# Altium schematic sheet Device.SchDoc
size A4
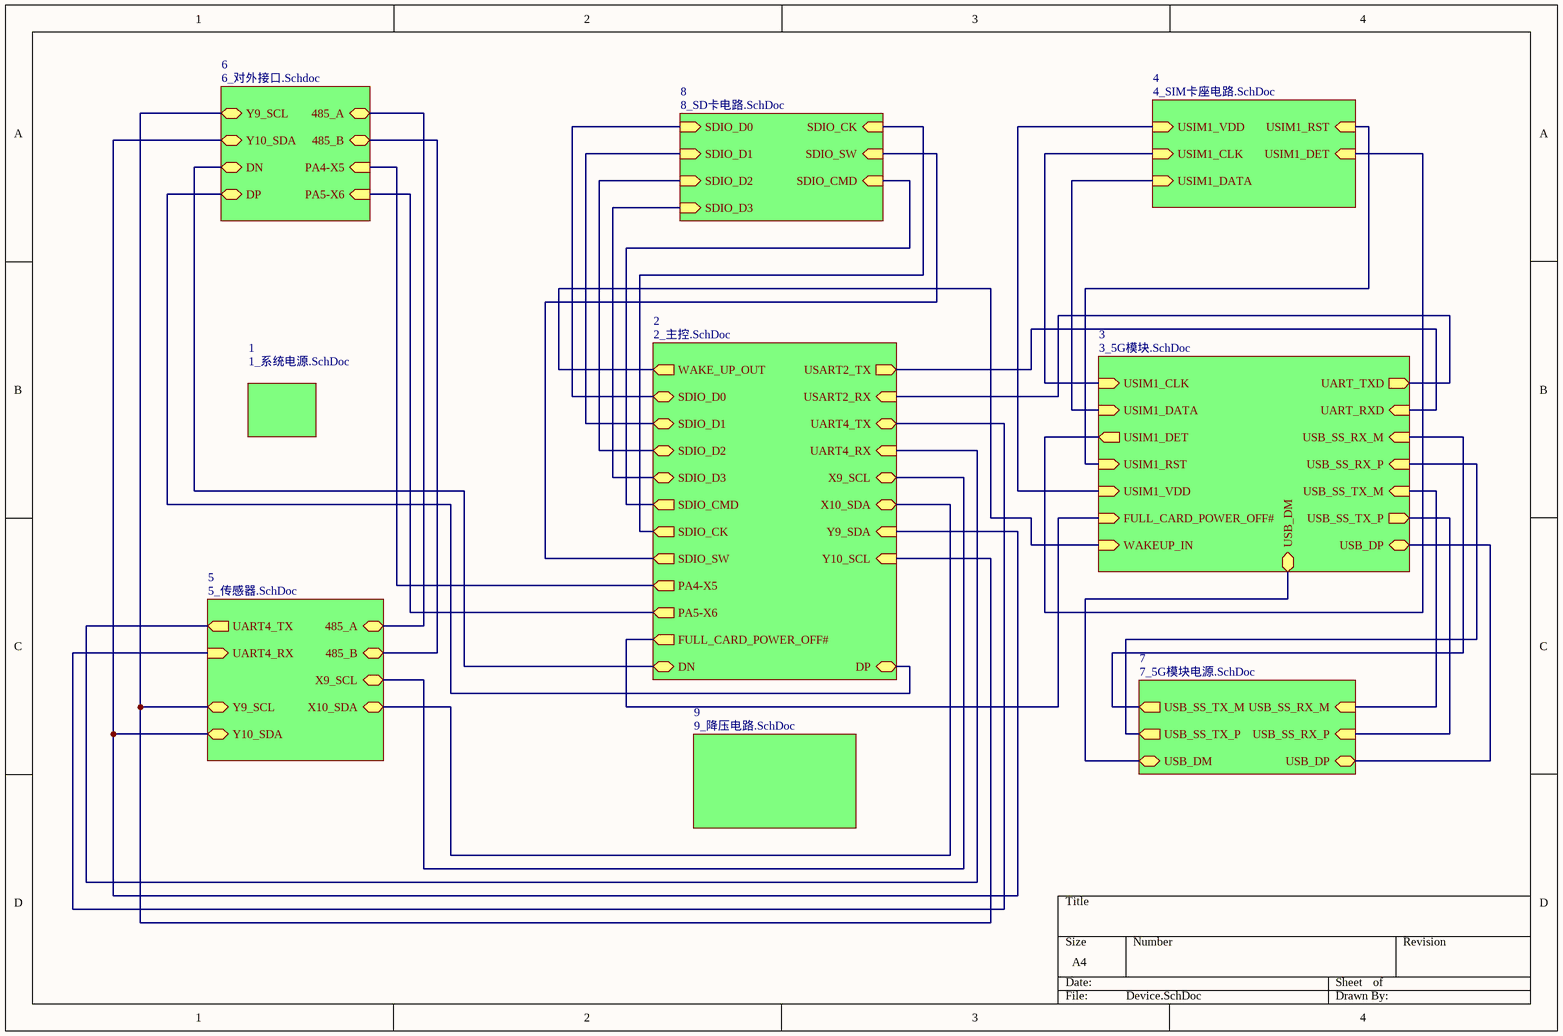
[diagram p0: Device.SchDoc]

## Sub-sheets
1 = 1_系统电源.SchDoc: no entries
2 = 2_主控.SchDoc: USART2_TX (out), USART2_RX (in), UART4_TX (bidir), UART4_RX (in), X9_SCL (bidir), X10_SDA (bidir), Y9_SDA (in), Y10_SCL (in), PA4-X5 (out), PA5-X6 (out), SDIO_D0 (bidir), SDIO_D1 (bidir), SDIO_D2 (bidir), SDIO_D3 (bidir), SDIO_SW (out), SDIO_CK (out), SDIO_CMD (out), FULL_CARD_POWER_OFF# (out), WAKE_UP_OUT (out), DN (bidir), DP (bidir)
3 = 3_5G模块.SchDoc: USIM1_CLK (in), USIM1_DATA (in), USIM1_DET (out), USIM1_RST (in), USIM1_VDD (in), UART_TXD (out), UART_RXD (in), FULL_CARD_POWER_OFF# (in), USB_SS_RX_M (in), USB_SS_RX_P (in), USB_SS_TX_M (in), USB_SS_TX_P (out), WAKEUP_IN (in), USB_DP (bidir), USB_DM (bidir)
4 = 4_SIM卡座电路.SchDoc: USIM1_VDD (in), USIM1_CLK (in), USIM1_DATA (in), USIM1_RST (in), USIM1_DET (in)
5 = 5_传感器.SchDoc: UART4_TX (out), UART4_RX (in), 485_A (bidir), 485_B (bidir), X9_SCL (bidir), X10_SDA (bidir), Y9_SCL (bidir), Y10_SDA (bidir)
6 = 6_对外接口.Schdoc: Y9_SCL (bidir), Y10_SDA (bidir), 485_A (bidir), 485_B (bidir), PA4-X5 (in), PA5-X6 (in), DN (bidir), DP (bidir)
7 = 7_5G模块电源.SchDoc: USB_SS_TX_M (out), USB_SS_TX_P (out), USB_SS_RX_M (in), USB_SS_RX_P (in), USB_DM (bidir), USB_DP (bidir)
8 = 8_SD卡电路.SchDoc: SDIO_D0 (in), SDIO_D1 (in), SDIO_D2 (in), SDIO_D3 (in), SDIO_CK (in), SDIO_SW (in), SDIO_CMD (in)
9 = 9_降压电路.SchDoc: no entries

## Nets
(unnamed): sheet 2/USART2_TX, sheet 3/UART_RXD
(unnamed): sheet 2/USART2_RX, sheet 3/UART_TXD
(unnamed): sheet 2/UART4_TX, sheet 5/UART4_RX
(unnamed): sheet 2/UART4_RX, sheet 5/UART4_TX
(unnamed): sheet 2/X9_SCL, sheet 5/X9_SCL
(unnamed): sheet 2/X10_SDA, sheet 5/X10_SDA
(unnamed): sheet 2/Y9_SDA, sheet 5/Y10_SDA, sheet 6/Y10_SDA
(unnamed): sheet 2/Y10_SCL, sheet 5/Y9_SCL, sheet 6/Y9_SCL
(unnamed): sheet 2/PA4-X5, sheet 6/PA4-X5
(unnamed): sheet 2/PA5-X6, sheet 6/PA5-X6
(unnamed): sheet 2/SDIO_D0, sheet 8/SDIO_D0
(unnamed): sheet 2/SDIO_D1, sheet 8/SDIO_D1
(unnamed): sheet 2/SDIO_D2, sheet 8/SDIO_D2
(unnamed): sheet 2/SDIO_D3, sheet 8/SDIO_D3
(unnamed): sheet 2/SDIO_SW, sheet 8/SDIO_SW
(unnamed): sheet 2/SDIO_CK, sheet 8/SDIO_CK
(unnamed): sheet 2/SDIO_CMD, sheet 8/SDIO_CMD
(unnamed): sheet 2/FULL_CARD_POWER_OFF#, sheet 3/FULL_CARD_POWER_OFF#
(unnamed): sheet 2/WAKE_UP_OUT, sheet 3/WAKEUP_IN
(unnamed): sheet 2/DN, sheet 6/DN
(unnamed): sheet 2/DP, sheet 6/DP
(unnamed): sheet 3/USIM1_CLK, sheet 4/USIM1_CLK
(unnamed): sheet 3/USIM1_DATA, sheet 4/USIM1_DATA
(unnamed): sheet 3/USIM1_DET, sheet 4/USIM1_DET
(unnamed): sheet 3/USIM1_RST, sheet 4/USIM1_RST
(unnamed): sheet 3/USIM1_VDD, sheet 4/USIM1_VDD
(unnamed): sheet 3/USB_SS_RX_M, sheet 7/USB_SS_TX_M
(unnamed): sheet 3/USB_SS_RX_P, sheet 7/USB_SS_TX_P
(unnamed): sheet 3/USB_SS_TX_M, sheet 7/USB_SS_RX_M
(unnamed): sheet 3/USB_SS_TX_P, sheet 7/USB_SS_RX_P
(unnamed): sheet 3/USB_DP, sheet 7/USB_DP
(unnamed): sheet 3/USB_DM, sheet 7/USB_DM
(unnamed): sheet 5/485_A, sheet 6/485_A
(unnamed): sheet 5/485_B, sheet 6/485_B